# Altium schematic sheet half-bridge.SchDoc
size A4
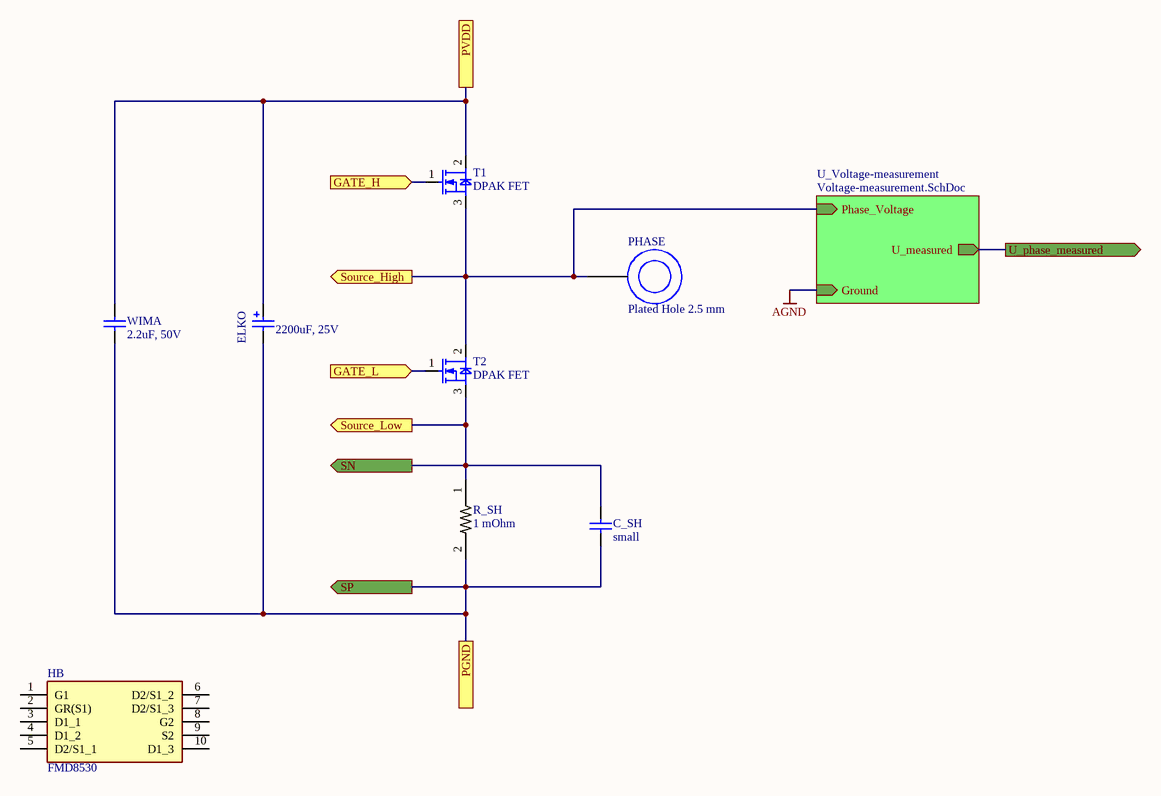
[diagram p0: half-bridge.SchDoc]

## Parts
C_SH  small  [FP_0805_CAP_085]
ELKO  2200uF, 25V  [WCAP-ATG8_13x25 -no_modell]
HB  FMD8530  [FMD8530]
PHASE  Plated Hole 2.5 mm  [Plated Hole 2.5mm]
R_SH  1 mOhm  [RESC6331X88N]
T1  DPAK FET  [DPAK]
T2  DPAK FET  [DPAK]
WIMA  2.2uF, 50V  [WIMA MKS2]

## Sub-sheets
U_Voltage-measurement = Voltage-measurement.SchDoc: Phase_Voltage (in), Ground (in), U_measured (out)

## Ports
GATE_H (in), GATE_L (in), PGND, PVDD, SN (out), Source_High (out), Source_Low (out), SP (out), U_phase_measured (out)

## Nets
AGND: sheet U_Voltage-measurement/Ground
GATE_H: T1.1(G) ; port GATE_H
GATE_L: T2.1(G) ; port GATE_L
PGND: C_SH.2 ELKO.1(N) R_SH.2 WIMA.2(N) ; port SP, port PGND
PVDD: ELKO.2(P) T1.2(D) WIMA.1(P) ; port PVDD
SN: C_SH.1 R_SH.1 T2.3(S) ; port SN, port Source_Low
Source_High: PHASE.1 T1.3(S) T2.2(D) ; port Source_High, sheet U_Voltage-measurement/Phase_Voltage
U_phase_measured: port U_phase_measured, sheet U_Voltage-measurement/U_measured

Not connected (* = marked no-connect by the designer): HB 1(G1) 2(GR(S1)) 3(D1_1) 4(D1_2) 5(D2/S1_1) 6(D2/S1_2) 7(D2/S1_3) 8(G2) 9(S2) 10(D1_3)

## Library data of the parts
C_SH = CAP: Capacitor; Value: small
ELKO = 860010478021: WCAP-ATG8 THT Aluminum Electrolytic Capacitors, D13mm x L25mm, 2200uF, +/-20%, 25VDC; Dissipation Factor: 16%; Endurance: 2000h; Leakage Current: 550uA; Ripple Current max.: 1705mA; Technical Reference: ATBI250222M025DSPACB000; ComponentLink1Description: Manufacturer; ComponentLink1URL: http://www.we-online.de; ComponentLink2Description: Datasheet; ComponentLink2URL: https://katalog.we-online.com/pbs/datasheet/860010478021.pdf; Length: 25mm; Mounting Technology: THT; Operating Temperature: -40 to +85degC; Packaging: Ammo Pack; Published Date: August 2019; Capacitance: 2200uF; Diameter: 13mm; Part Number: 860010478021; Publisher: Wurth Elektronik; Capacitance Tolerance: +/-20%; Rated Voltage: 25VDC
R_SH = WSLF25121
WIMA = WIMA_MKS2: MKS2B042201F00KSSD -  DC Film Capacitor, 2.2 µF, 50 V, Metallized PET, ± 10%, MKS2 Series; ComponentLink1Description: farnell.com; ComponentLink1URL: https://hu.farnell.com/wima/mks2b042201f00kssd/cap-2-2-f-50v-10-pet/dp/107422